# Altium schematic sheet Resolver.SchDoc
size A4; CompanyName: Technische Hochschule Nürnberg Georg Simon Ohm; Organization: UltraZohm; Address1: Kesslerplatz 12; Address2: 90489 Nürnberg; Address3: GERMANY; DocumentNumber: 10; SheetNumber: 10; SheetTotal: 12; Website: www.ultrazohm.com
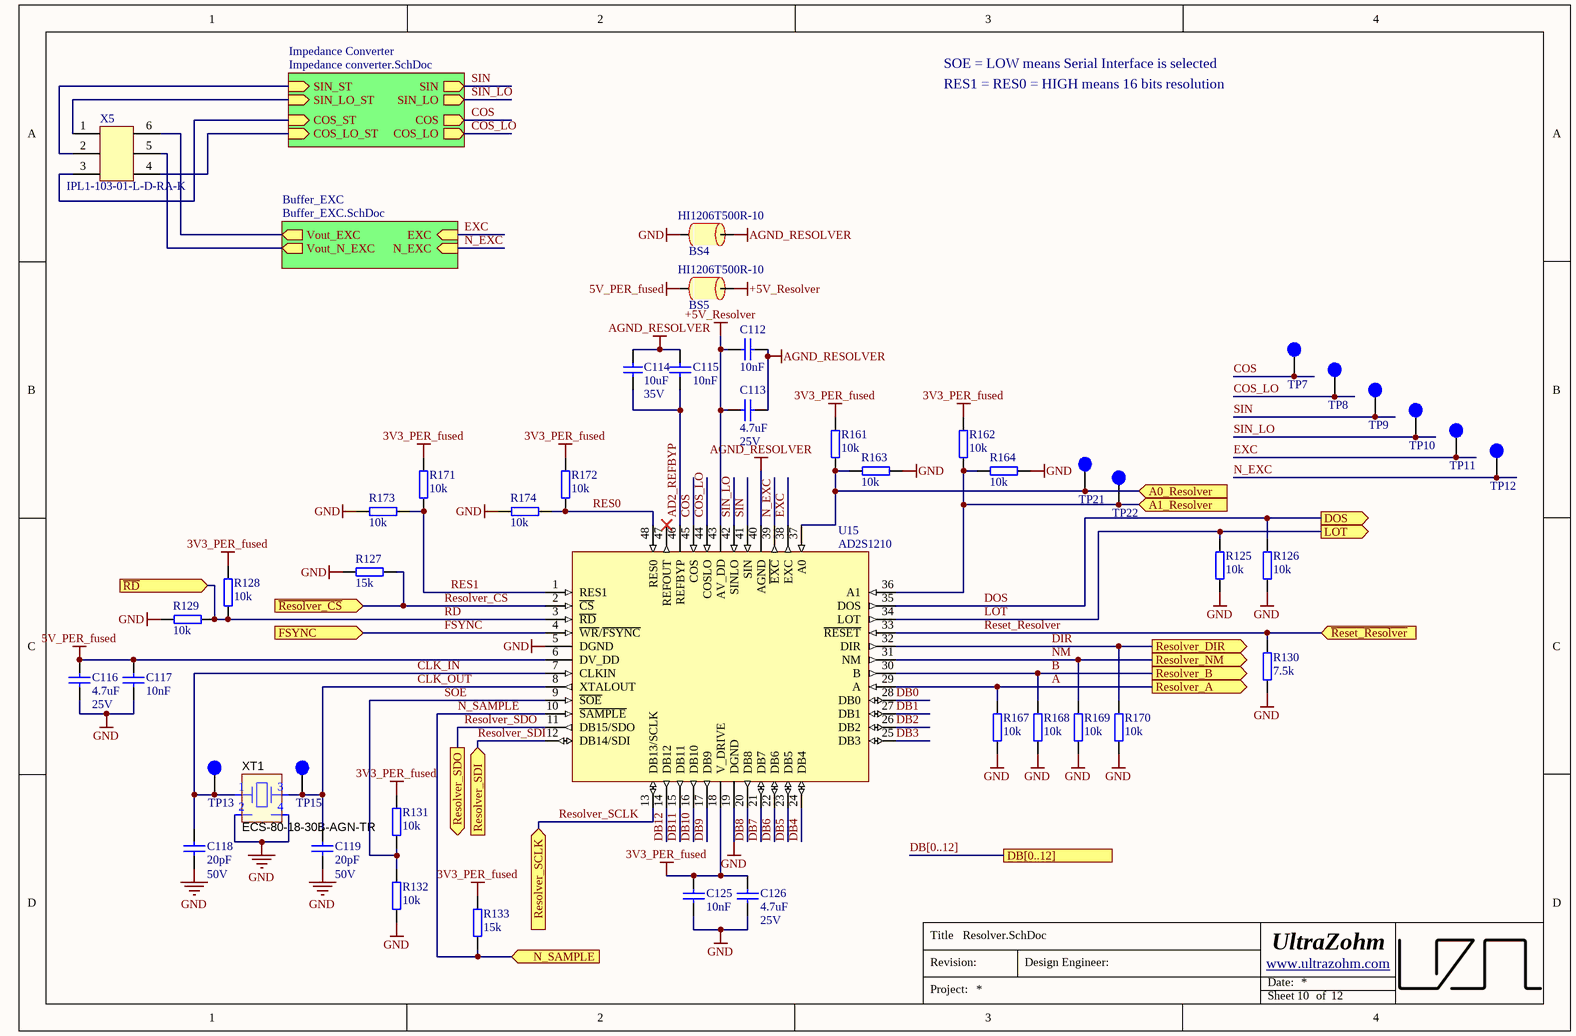
[diagram p0: Resolver.SchDoc]

## Parts
BS4  HI1206T500R-10  [RES_1206]
BS5  HI1206T500R-10  [RES_1206]
C112  10nF  [CAPC1608X07N]
C113  4.7uF  Voltage: 25V  [CAPC1608X07N]
C114  10uF  Voltage: 35V  [C_1206]
C115  10nF  [CAPC1608X07N]
C116  4.7uF  Voltage: 25V  [CAPC1608X07N]
C117  10nF  [CAPC1608X07N]
C118  20pF  Voltage: 50V  [CAPC1608X07N]
C119  20pF  Voltage: 50V  [CAPC1608X07N]
C125  10nF  [CAPC1608X07N]
C126  4.7uF  Voltage: 25V  [CAPC1608X07N]
R125  10k  [RESC1608X06N]
R126  10k  [RESC1608X06N]
R127  15k  [RESC1608X06N]
R128  10k  [RESC1608X06N]
R129  10k  [RESC1608X06N]
R130  7.5k  [RESC1608X06N]
R131  10k  [RESC1608X06N]
R132  10k  [RESC1608X06N]
R133  15k  [RESC1608X06N]
R161  10k  [RESC1608X06N]
R162  10k  [RESC1608X06N]
R163  10k  [RESC1608X06N]
R164  10k  [RESC1608X06N]
R167  10k  [RESC1608X06N]
R168  10k  [RESC1608X06N]
R169  10k  [RESC1608X06N]
R170  10k  [RESC1608X06N]
R171  10k  [RESC1608X06N]
R172  10k  [RESC1608X06N]
R173  10k  [RESC1608X06N]
R174  10k  [RESC1608X06N]
TP7  VCC  [TP_1mm]  (value not drawn)
TP8  VCC  [TP_1mm]  (value not drawn)
TP9  VCC  [TP_1mm]  (value not drawn)
TP10  VCC  [TP_1mm]  (value not drawn)
TP11  VCC  [TP_1mm]  (value not drawn)
TP12  VCC  [TP_1mm]  (value not drawn)
TP13  VCC  [TP_1mm]  (value not drawn)
TP15  VCC  [TP_1mm]  (value not drawn)
TP21  VCC  [TP_1mm]  (value not drawn)
TP22  VCC  [TP_1mm]  (value not drawn)
U15  AD2S1210  [LQFP-48_L]
X5  IPL1-103-01-L-D-RA-K  [Conector 3x2 TH Horizontal]
XT1  ECS-80-18-30B-AGN-TR  [CRYSTALOSC]

## Sub-sheets
Buffer_EXC = Buffer_EXC.SchDoc: Vout_EXC (out), Vout_N_EXC (out), N_EXC (in), EXC (in)
Impedance Converter = Impedance converter.SchDoc: SIN_LO (out), COS_LO_ST (in), SIN_ST (in), SIN_LO_ST (in), COS_ST (in), SIN (out), COS_LO (out), COS (out)

## Ports
A0_Resolver (in), A1_Resolver (in), DB[0..12], DOS (out), FSYNC (in), LOT (out), N_SAMPLE (in), Resolver_A (out), Resolver_B (out), Resolver_DIR (out), Resolver_NM (out), Resolver_SCLK (in), Resolver_SDI (in), Resolver_SDO (out), ~{RD} (in), ~{Reset_Resolver} (in), ~{Resolver_CS} (in)

## Nets
3V3_PER_fused: C125.2 C126.2 R128.2 R131.2 R133.2 R161.2 R162.2 R171.2 R172.2 U15.18(V_DRIVE)
5V_PER_fused: BS5.2 C116.2 C117.2 U15.6(DV_DD)
+5V_Resolver: BS5.1 C112.1 C113.1 U15.43(AV_DD)
AGND_RESOLVER: BS4.1 C112.2 C113.2 C114.2 C115.2 U15.40(AGND)
GND: BS4.2 C116.1 C117.1 C118.2 C119.2 C125.1 C126.1 R125.1 R126.1 R127.2 R129.1 R130.2 R132.1 R163.1 R164.1 R167.1 R168.1 R169.1 R170.1 R173.1 R174.1 U15.5(DGND) U15.19(DGND) XT1.2(GND) XT1.4(GND)
~{RD}: R128.1 R129.2 U15.3(~{RD}) ; port ~{RD}
~{Reset_Resolver}: R130.1 U15.33(~{RESET}) ; port ~{Reset_Resolver}
~{Resolver_CS}: R127.1 U15.2(~{CS}) ; port ~{Resolver_CS}
~{SOE}: R131.1 R132.2 U15.9(~{SOE})
A: R167.2 U15.29(A) ; port Resolver_A
A0_Resolver: R161.1 R163.2 TP21.1 U15.37(A0) ; port A0_Resolver
A1_Resolver: R162.1 R164.2 TP22.1 U15.36(A1) ; port A1_Resolver
AD2_REFBYP: C114.1 C115.1 U15.46(REFBYP)
B: R168.2 U15.30(B) ; port Resolver_B
CLK_IN: C118.1 TP13.1 U15.7(CLKIN) XT1.1(IN)
CLK_OUT: C119.1 TP15.1 U15.8(XTALOUT) XT1.3(OUT)
COS: TP7.1 U15.45(COS) ; sheet Impedance Converter/COS
COS_LO: TP8.1 U15.44(COSLO) ; sheet Impedance Converter/COS_LO
DB0: U15.28(DB0)
DB1: U15.27(DB1)
DB2: U15.26(DB2)
DB3: U15.25(DB3)
DB4: U15.24(DB4)
DB5: U15.23(DB5)
DB6: U15.22(DB6)
DB7: U15.21(DB7)
DB8: U15.20(DB8)
DB9: U15.17(DB9)
DB10: U15.16(DB10)
DB11: U15.15(DB11)
DB12: U15.14(DB12)
DIR: R170.2 U15.32(DIR) ; port Resolver_DIR
DOS: R126.2 U15.35(DOS) ; port DOS
EXC: TP11.1 U15.38(EXC) ; sheet Buffer_EXC/EXC
FSYNC: U15.4(~{WR}/~{FSYNC}) ; port FSYNC
LOT: R125.2 U15.34(LOT) ; port LOT
N_EXC: TP12.1 U15.39(~{EXC}) ; sheet Buffer_EXC/N_EXC
N_SAMPLE: R133.1 U15.10(~{SAMPLE}) ; port N_SAMPLE
NM: R169.2 U15.31(NM) ; port Resolver_NM
RES0: R172.1 R174.2 U15.48(RES0)
RES1: R171.1 R173.2 U15.1(RES1)
Resolver_SCLK: U15.13(DB13/SCLK) ; port Resolver_SCLK
Resolver_SDI: U15.12(DB14/SDI) ; port Resolver_SDI
Resolver_SDO: U15.11(DB15/SDO) ; port Resolver_SDO
SIN: TP9.1 U15.41(SIN) ; sheet Impedance Converter/SIN
SIN_LO: TP10.1 U15.42(SINLO) ; sheet Impedance Converter/SIN_LO
NetX5_1: X5.1 ; sheet Impedance Converter/SIN_LO_ST
NetX5_2: X5.2 ; sheet Impedance Converter/SIN_ST
NetX5_3: X5.3 ; sheet Impedance Converter/COS_ST
NetX5_4: X5.4 ; sheet Impedance Converter/COS_LO_ST
NetX5_5: X5.5 ; sheet Buffer_EXC/Vout_N_EXC
NetX5_6: X5.6 ; sheet Buffer_EXC/Vout_EXC

Not connected (* = marked no-connect by the designer): U15 47(REFOUT)*

## Buses and harness runs
bus DB[0..12] = port DB[0..12]

## Notes on the sheet
- SOE = LOW means Serial Interface is selected
- RES1 = RES0 = HIGH means 16 bits resolution
- Title
- Revision:
- Design Engineer:
- Date:
- Project:
- Sheet
- of

## Library data of the parts
BS4 BS5 = Bead: Ferrite bead 6A; MF: Laird; Supplier Part Number 2: 240-2412-1-ND; MFN: HI1206T500R-10; Supplier 2: Digi-Key; Supplier 1: Mouser; Supplier Part Number 1: 875-HI1206T500R-10; Package: 1206
C112 C115 C117 C125 = Cap_0603: MPN: 885012206065; MF: Würth; Voltage: 25V; Value: 10nF; Supplier 1: Mouser; Supplier 2: *; Supplier Part Number 1: 710-885012206065; Supplier Part Number 2: *
C113 C116 C118 C119 C126 = Cap_0603: MF: *; MPN: *; Supplier 1: *; Supplier 2: *; Supplier Part Number 1: *; Supplier Part Number 2: *
  C113 C116 C126: Value: 4.7uF
  C118 C119: Value: 20pF
C114 = C_1206: Capacitor 1206; MPN: GRM319R6YA106KA12D; Tolerance: 10%; MF: Murata Electronics; Dielectric: X5R; Package: 1206; Value: 10uF; Created: 2018_06_25_AGeiger; Supplier 1: Mouser; Supplier Part Number 1: 81-GRM319R6YA106KA2D
R125-R129 R131-R133 R161-R164 R167-R174 = R_0603: MPN: CRCW06030000Z0EAC; MF: Vishay; Supplier 1: Mouser; Supplier Part Number 1: 71-CRCW06030000Z0EAC
  R125 R126 R128 R129 R131 R132 R161-R164 R167-R174: Value: 10k
  R127 R133: Value: 15k
R130 = R_0603: Value: 7.5k; Supplier 1: Mouser
TP7-TP13 TP15 TP21 TP22 = TP_1mm: Testpoint 1mm; Created: 2018_06_25_AGeiger; Value: Testpoint 1mm
U15 = AD2S1210: Variable Resolution, 10-Bit to 16-Bit R/D Converter with Reference Oscillator; MPN: AD2S1210WDSTZRL7; MF: Analog Devices; Package: LQFP-48; Value: AD2S1210; Created: 2019_04_20_AGeiger; ComponentLink1Description: Datasheet; ComponentLink1URL: https://www.analog.com/media/en/technical-documentation/data-sheets/AD2S1210.pdf; Supplier 1: Mouser; Supplier Part Number 1: 584-AD2S1210WDSTZR7; Supplier Part Number 2: AD2S1210WDSTZRL7CT-ND; Supplier 2: Digi-Key
X5 = Conector 3x2 Horizontal: CONN HEADER R/A 6 POS 2.54MM Through Hole; MF: Samtec; Supplier Part Number 2: SAM9096-ND; MPN: IPL1-103-01-L-D-RA-K; Supplier Part Number 1: 200-IPL110301LDRAK; Supplier 1: Mouser; Supplier 2: Digi-Key
XT1 = Crystal_8MHz: CRYSTAL 8MHZ 18PF SMD; MF: ECS; Supplier Part Number 2: XC2709CT-ND; MPN: ECS-80-18-30B-AGN-TR; Supplier Part Number 1: 520-80-18-30B-AGNT; Supplier 1: Mouser; Package: 4-SMD; Supplier 2: Digi-Key